# EAGLE design RfM v4 KOVAN (EAGLE 7.1.0)
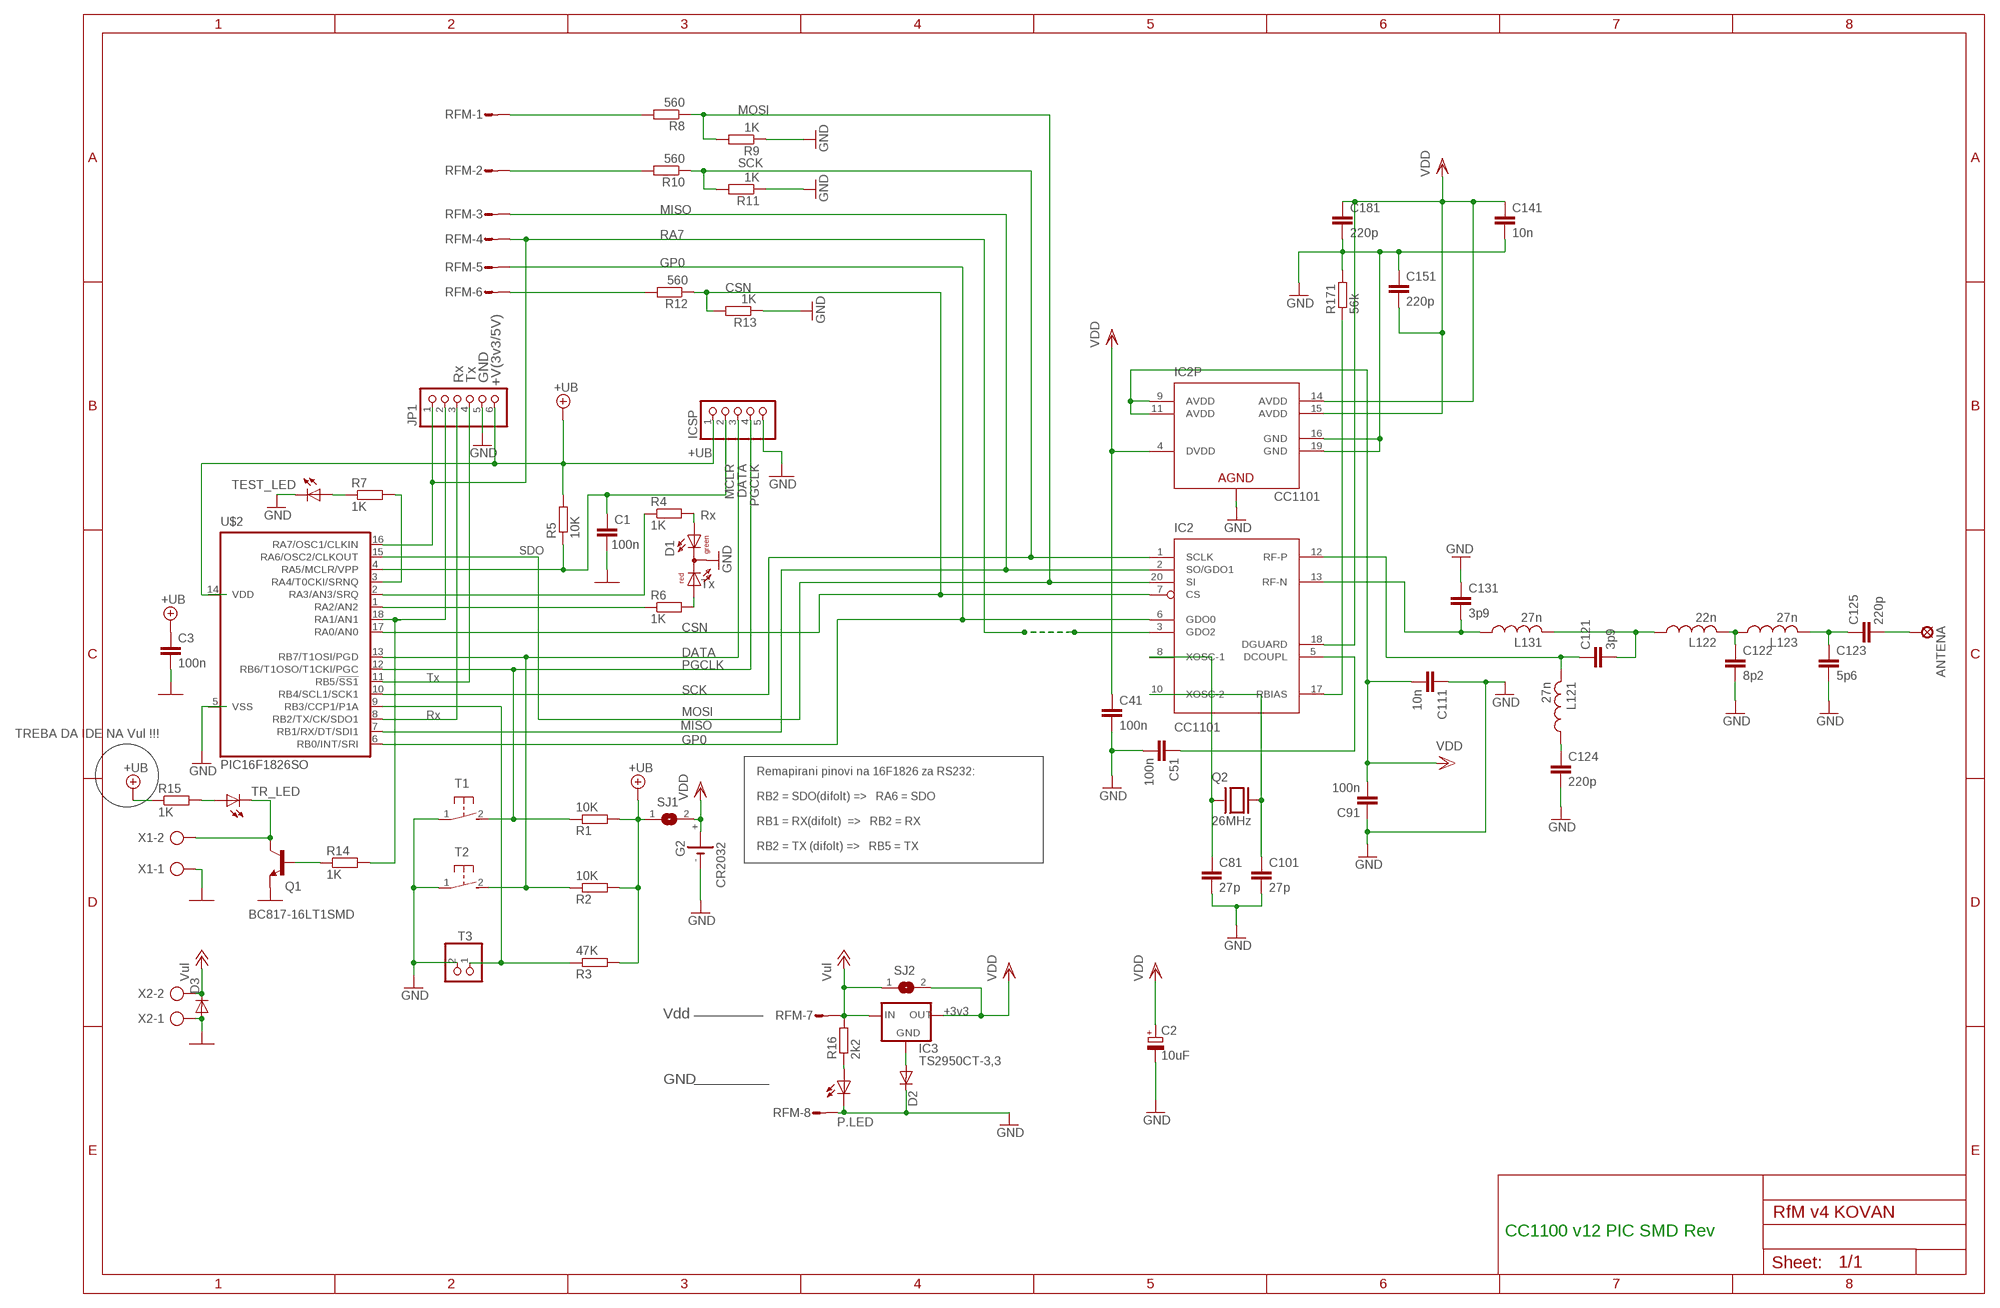
[diagram p0: schematic, sheet 1]

## Parts
ANTENA  SE13  [SE13]
C1  100n  C-EUC0805  [C0805]
C2  10uF  CPOL-EUSMD  [ALUCON]
C3  100n  C-EUC1206  [C1206]
C41  100n  C-EUC0402  [C0402]
C51  100n  C-EUC0402  [C0402]
C81  27p  C-EUC0402  [C0402]
C91  100n  C-EUC0402  [C0402]
C101  27p  C-EUC0402  [C0402]
C111  10n  C-EUC0402  [C0402]
C121  3p9  C-EUC0402  [C0402]
C122  8p2  C-EUC0402  [C0402]
C123  5p6  C-EUC0402  [C0402]
C124  220p  C-EUC0402  [C0402]
C125  220p  C-EUC0402  [C0402]
C131  3p9  C-EUC0402  [C0402]
C141  10n  C-EUC0402  [C0402]
C151  220p  C-EUC0402  [C0402]
C181  220p  C-EUC0402  [C0402]
D1  DUOLED2X5.  [DUOLED2X5*]
D2  1N4004SMD  [1N4007-SMD]
D3  1N4004SMD  [1N4007-SMD]
G2  CR2032  CR2032H,  [CR2032--]
IC2  CC1101  CC1100  [QLP-20]
IC3  TS2950CT-3,3  78LXX  [78LXX]
ICSP  PINHD-1X5.  [1X05.]
JP1  PINHD-1X6.  [1X06.]
L121  27n  L-USL0402  [C0402]
L122  22n  L-USL0402  [C0402]
L123  27n  L-USL0402  [C0402]
L131  27n  L-USL0402  [C0402]
P.LED  zelena  LEDCHIPLED_0805  [CHIPLED_0805]
Q1  BC817-16LT1SMD  [SOT23-BEC]
Q2  26MHz  XTALSMDMOJ  [SMD]
R1  10K  R-EU_R0805  [R0805]
R2  10K  R-EU_R0805  [R0805]
R3  47K  R-EU_R0603  [R0603]
R4  1K  R-EU_R0805  [R0805]
R5  10K  R-EU_R0603  [R0603]
R6  1K  R-EU_R0805  [R0805]
R7  1K  R-EU_R0603  [R0603]
R8  560  R-EU_R0603  [R0603]
R9  1K  R-EU_R0603  [R0603]
R10  560  R-EU_R0603  [R0603]
R11  1K  R-EU_R0603  [R0603]
R12  560  R-EU_R0603  [R0603]
R13  1K  R-EU_R0603  [R0603]
R14  1K  R-EU_R1206  [R1206]
R15  1K  R-EU_R0603  [R0603]
R16  2k2  R-EU_R0805  [R0805]
R171  56k  R-EU_R0402  [R0402]
RFM  MICROMATCH-8'  [MICROMATCH-8..]
SJ1  SJ  [SJ]
SJ2  SJ  [SJ]
T1  10-XX-1'  [3BF-10XX-1.]
T2  10-XX-1'  [3BF-10XX-1.]
T3  PINHD-1X2.  [1X02.]
TEST_LED  TEST_LED  LEDCHIPLED_0805  [CHIPLED_0805]
TR_LED  TEST_LED  LEDCHIPLED_0805  [CHIPLED_0805]
U$2  PIC16F1826SO  [SO-18W]
X1  AK300/2  [AK300/2]
X2  AK300/2  [AK300/2]

## Nets
+12V: D3.C IC3.IN R16.2 RFM.7 SJ2.1 X2.2 ; supply symbol labelled Vul
+UB: C3.2 ICSP.1 JP1.6 R1.2 R2.2 R3.2 R5.2 R15.1 SJ1.1 U$2.14(VDD)
CSN: IC2.7(CS) R12.1 R13.2 U$2.17(RA0/AN0)
DATA: ICSP.3 R2.1 T2.2(S) U$2.13(RB7/T1OSI/PGD)
DCOUPL: C51.2 IC2.5(DCOUPL)
GND: C1.1 C2.P$1(-) C3.1 C41.1 C51.1 C81.1 C91.2 C101.1 C111.2 C122.1 C123.1 C124.1 C131.2 C141.1 C151.2 C181.1 D1.K(C) D2.C D3.A G2.- IC2.16(GND) IC2.19(GND) IC2.21(AGND) ICSP.5 JP1.5 Q1.E R9.1 R11.1 R13.1 R171.2 RFM.8 T1.1(P) T2.1(P) T3.2 TEST_LED.C U$2.5(VSS) X1.1 X2.1
GP0: IC2.6(GDO0) RFM.5 U$2.6(RB0/INT/SRI)
MCLR: C1.2 ICSP.2 R5.1 U$2.4(RA5/MCLR/VPP)
MISO: IC2.2(SO/GDO1) RFM.3 U$2.7(RB1/RX/DT/SDI1)
MOSI: IC2.20(SI) R8.1 R9.2 U$2.15(RA6/OSC2/CLKOUT)
N$1: IC2.17(RBIAS) R171.1
N$2: C101.2 IC2.10(XOSC-2) Q2.P$5
N$3: C81.2 IC2.8(XOSC-1) Q2.P$3
N$4: C131.1 IC2.13(RF-N) L131.2
N$5: C121.2 IC2.12(RF-P) L121.1
N$7: C124.2 L121.2
N$8: C123.2 C125.2 L123.1
N$9: C122.2 L122.1 L123.2
N$10: ANTENA.MP C125.1
N$13: D1.AG R4.2
N$14: R7.1 TEST_LED.A
N$15: C121.1 L122.2 L131.1
N$33: D1.AR R6.2
N$35: JP1.2 R14.2 U$2.18(RA1/AN1)
N$38: Q1.B R14.1
N$40: R15.2 TR_LED.A
N$41: Q1.C TR_LED.C X1.2
N$45: D2.A IC3.GND
N$48: IC2.3(GDO2)
N$56: R8.2 RFM.1
N$57: R10.2 RFM.2
N$58: R12.2 RFM.6
N$60: P.LED.A R16.1
N$61: P.LED.C
PGCLK: ICSP.4 R1.1 T1.2(S) U$2.12(RB6/T1OSO/T1CKI/PGC)
RA2: R6.1 U$2.1(RA2/AN2)
RA3: R4.1 U$2.2(RA3/AN3/SRQ)
RA4: R7.2 U$2.3(RA4/T0CKI/SRNQ)
RA7: JP1.1 RFM.4 U$2.16(RA7/OSC1/CLKIN)
RB3: R3.1 T3.1 U$2.9(RB3/CCP1/P1A)
RX: JP1.3 U$2.8(RB2/TX/CK/SDO1)
SCK: IC2.1(SCLK) R10.1 R11.2 U$2.10(RB4/SCL1/SCK1)
TX: JP1.4 U$2.11(RB5/!SS1)
VDD: C2.P$4(+) C41.2 C91.1 C111.1 C141.2 C151.1 C181.2 G2.+ G2.+@1(+) IC2.4(DVDD) IC2.9(AVDD) IC2.11(AVDD) IC2.14(AVDD) IC2.15(AVDD) IC2.18(DGUARD) IC3.OUT SJ1.2 SJ2.2

## Notes on the sheet
- Rx | Tx | GND | +V(3v3/5V)
- Rx
- SDO
- Tx
- Tx
- Rx
- TREBA DA IDE NA Vul !!!
- Remapirani pinovi na 16F1826 za RS232:
- RB2 = SDO(difolt) =>   RA6 = SDO
- RB1 = RX(difolt)  =>   RB2 = RX
- RB2 = TX (difolt) =>   RB5 = TX
- Vdd | +3v3
- GND
- CC1100 v12 PIC SMD Rev

## Library data of the parts
ANTENA = solpad:SE13: SOLDER PAD E1542, drill 1,3mm, distributor Buerklin, 07F815
C1 C3 C41 C51 C81 C91 C101 C111 C121-C125 C131 C141 C151 C181 = rcl:C-EU: CAPACITOR, European symbol
C2 = rcl:CPOL-EU: POLARIZED CAPACITOR, European symbol
D1 = led_1:DUOLED2X5: DUO LED 2 colors, 2.5 x 5 mm, recangle
D2 D3 = diode_1:1N4004: DIODE general purpose rectifier, 1 A
G2 = battery:CR2032H: LI BATTERY Varta
IC2 = chipcon-ti:CC1100: Single Chip Low Cost Low Power RF Transceiver 315/433/868 and 915 MHz ISM/SRD band systems
IC3 = v-reg:78LXX: VOLTAGE REGULATOR
ICSP = pinhead:PINHD-1X5: PIN HEADER
JP1 = pinhead:PINHD-1X6: PIN HEADER
L121-L123 L131 = rcl:L-US: INDUCTOR, American symbol
P.LED TEST_LED TR_LED = LED:LED: LED OSRAM: - CHIPLED LG R971, LG N971, LY N971, LG Q971, LY Q971, LO R971, LY R971 LH N974, LH R974 LS Q976, LO Q976, LY Q976 LO Q996 - Hyper CHIPLED LW Q18S LB Q993, LB Q99A, LB R99A - SideLED LS A670, LO A670, LY A670, LG A670, LP A670 LB A673, LV A673, LT A673, LW A673 LH A674 LY A675 LS A676, LA A676, LO A676, LY A676, LW A676 LS A679, LY A679, LG A679 - Hyper Micro SIDELED® LS Y876, LA Y876, LO Y876, LY Y876 LT Y87S - SmartLED LW L88C, LW L88S LB L89C, LB L89S, LG L890 LS L89K, LO L89K, LY L89K LS L896, LA L896, LO L896, LY L896 - TOPLED LS T670, LO T670, LY T670, LG T670, LP T670 LSG T670, LSP T670, LSY T670, LOP T670, LYG T670 LG T671, LOG T671, LSG T671 LB T673, LV T673, LT T673, LW T673 LH T674 LS T676, LA T676, LO T676, LY T676, LB T676, LH T676, LSB T676, LW T676 LB T67C, LV T67C, LT T67C, LS T67K, LO T67K, LY T67K, LW E67C LS E67B, LA E67B, LO E67B, LY E67B, LB E67C, LV E67C, LT E67C LW T67C LS T679, LY T679, LG T679 LS T770, LO T770, LY T770, LG T770, LP T770 LB T773, LV T773, LT T773, LW T773 LH T774 LS E675, LA E675, LY E675, LS T675 LS T776, LA T776, LO T776, LY T776, LB T776 LHGB T686 LT T68C, LB T68C - Hyper Mini TOPLED® LB M676 - Mini TOPLED Santana® LG M470 LS M47K, LO M47K, LY M47K Source: http://www.osram.convergy.de/
Q1 = transistor-npn:BC817*: NPN Transistor
Q2 = special:XTAL: CRYSTAL
R1-R6 = moja:R-EU_: RESISTOR, European symbol
R7 R14-R16 = rcl-1:R-EU_: RESISTOR, European symbol
R8-R13 R171 = rcl:R-EU_: RESISTOR, European symbol
RFM = con-amp-micromatch:MICROMATCH-8: MicroMaTch 8 7-215464-8 / 0-215464-8 Drawing Number C-215464 DDEController.pdf
SJ1 SJ2 = jumper:SJ: SMD solder JUMPER
T1 T2 = switch-omron:10-XX-1
T3 = pinhead:PINHD-1X2: PIN HEADER
U$2 = microchip-4:PIC16F1826
X1 X2 = con-ptr500:AK300/2: CONNECTOR

## Net classes
0 gnd: clearance 0.762 mm
1 POWER: width 0.406 mm, clearance 0.381 mm

## Board
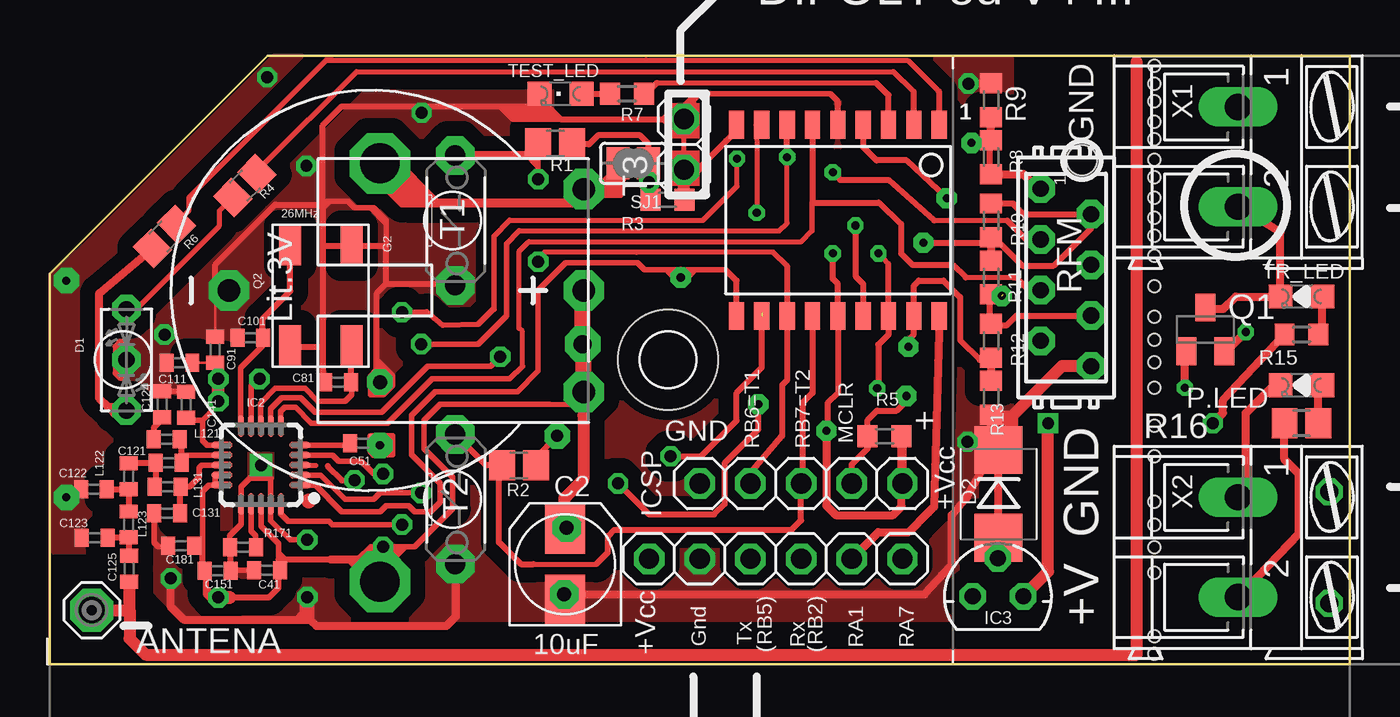
[diagram p1: board, top side]
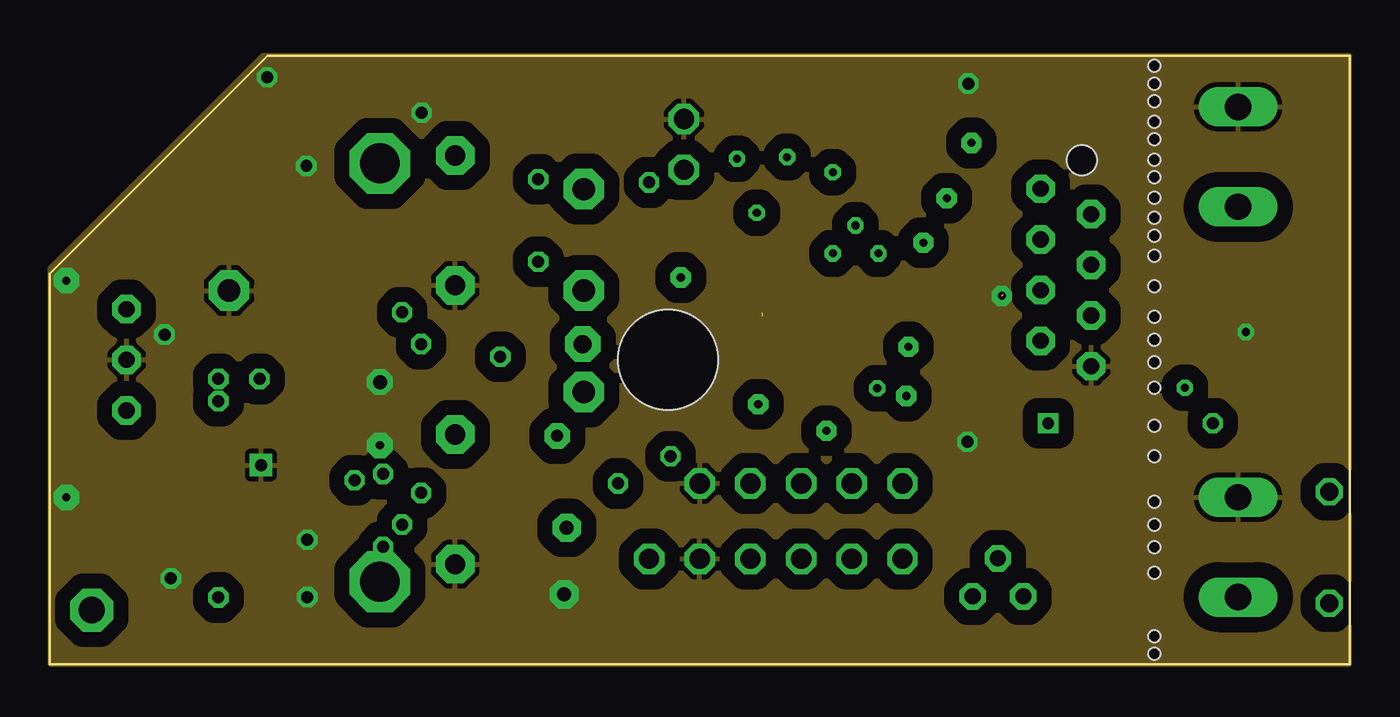
[diagram p2: board, inner layer GND$]
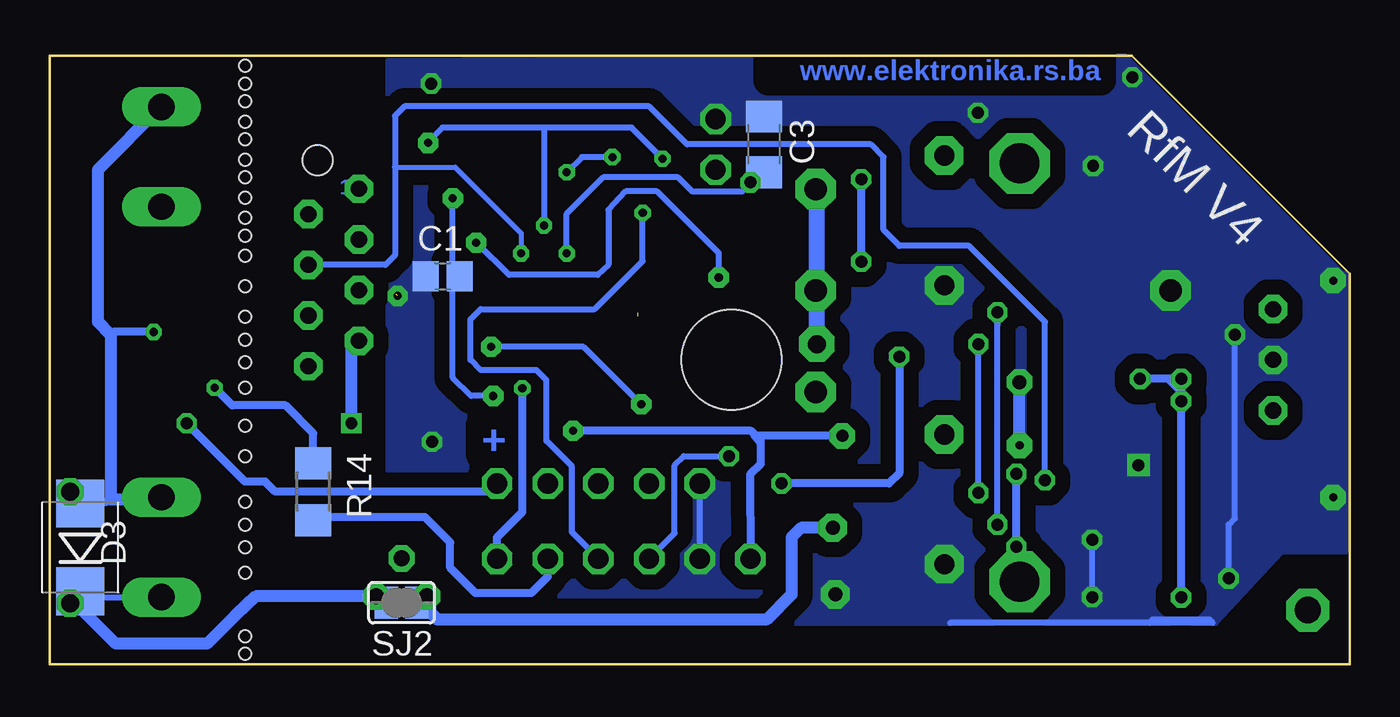
[diagram p3: board, bottom side, seen from below]

Size 65.15 x 30.48 mm. Coordinates in mm from the lower left corner, seen from the top.
Outline: 0,0 0,19.56 10.92,30.48 65.15,30.48 65.15,0 0,0
Copper layers (1+2*16): Top 0.035mm / dielectric 0.75mm / GND$ 0.035mm / dielectric 0.75mm / Bottom 0.035mm
Design rules "default": minimum track width 10mil, minimum drill 24mil, track to track 10mil, track to pad 10mil, pad to pad 10mil, via to via 8mil, smd to smd 10mil, copper to edge 0mil, drill to drill 8mil, minimum pad ring 10mil, minimum via ring 8mil, stop-mask expansion 0mil, vias tented up to drill 0mil, thermal gap 10mil
Holes 0.6 mm at 55.37,29.08 55.37,27.18 55.37,25.27 55.37,21.46 55.37,17.4 55.37,13.84 55.37,11.94 55.37,10.41 55.37,8.13 55.37,0.51 55.37,29.97 55.37,26.29 55.37,24.38 55.37,22.35 55.37,20.45 55.37,18.92 55.37,16.26 55.37,6.99 55.37,4.57 55.37,1.4 55.37,15.11 55.37,23.37 55.37,5.84 55.37,28.19

### Footprints (pad centres in the part's own frame; a part is rotated, then mirrored left to right if it is on the bottom)
SE13 = drill 1.321 pad 2.159 octagon: MP 0,0
C0805 = smd 1.3 x 1.5: 1 -0.85,0; 2 0.85,0
ALUCON = smd 2.5 x 2: P$1 -1.778,0; P$4 1.778,0
C1206 = smd 1.6 x 1.8: 1 -1.4,0; 2 1.4,0
C0402 = smd 0.7 x 0.9: 1 -0.65,0; 2 0.65,0
DUOLED2X5* = drill 0.813 pad 1.422 octagon: AG -2.54,0; AR 2.54,0; K 0,0
1N4007-SMD = smd 2.4 x 2.4: A 2.2,0; C -2.2,0
CR2032-- = drill 1.118 pad 2.032 octagon: + 5.08,10.795; +@1 -5.08,10.795; +@2 0,10.795; - 0,-6.985
QLP-20 = smd 1.041 x 0.3: 1 -1.954,1; 2 -1.951,0.5; 3 -1.951,0; 4 -1.951,-0.5; 5 -1.951,-1; 11 1.951,-1; 12 1.951,-0.5; 13 1.951,0; 14 1.951,0.5; 15 1.951,1 | smd 0.3 x 1.041: 6 -1,-1.951; 7 -0.5,-1.951; 8 0,-1.951; 9 0.5,-1.951; 10 1,-1.951; 16 1,1.951; 17 0.5,1.951; 18 0,1.951; 19 -0.5,1.951; 20 -1,1.951 | drill 0.6 pad 1 square: 21 0,0
78LXX = drill 0.813 octagon: GND 0,1.905; IN 1.27,0; OUT -1.27,0
1X05. = drill 1.016 octagon: 1 -5.08,0; 2 -2.54,0; 3 0,0; 4 2.54,0; 5 5.08,0
1X06. = drill 1.016 octagon: 1 -6.35,0; 2 -3.81,0; 3 -1.27,0; 4 1.27,0; 5 3.81,0; 6 6.35,0
CHIPLED_0805 = smd 1.2 x 1.2: A 0,-1.05; C 0,1.05
SOT23-BEC = smd 1 x 1.4: B -0.95,-1.1; C 0,1.1; E 0.95,-1.1
SMD = smd 2 x 1.1: P$2 -2.512,1.679; P$3 2.466,1.679; P$4 2.469,-1.41; P$5 -2.54,-1.397
R0805 = smd 1.3 x 1.5: 1 -0.85,0; 2 0.85,0
R0603 = smd 1 x 1.1: 1 -0.85,0; 2 0.85,0
R1206 = smd 1.6 x 1.803: 1 -1.422,0; 2 1.422,0
R0402 = smd 0.7 x 0.9: 1 -0.65,0; 2 0.65,0
MICROMATCH-8.. = drill 0.813 pad 1.422 octagon: 1 4.445,1.27; 2 3.175,-1.27; 3 1.905,1.27; 4 0.635,-1.27; 5 -0.635,1.27; 6 -1.905,-1.27; 7 -3.175,1.27; 8 -4.445,-1.27 | hole 1.5: 5.874,-0.794
SJ = smd 1.168 x 1.6: 1 -0.762,0; 2 0.762,0
3BF-10XX-1. = drill 1.016 pad 1.93 octagon: 1 -3.251,0.356; 2 3.251,0.356
1X02. = drill 1.016 octagon: 1 -1.27,0; 2 1.27,0
KUTIJA_ZA_DALJINSKI = hole 5: 15.24,13.335
SO-18W = smd 0.762 x 1.397: 1 -5.08,-4.788; 2 -3.81,-4.788; 3 -2.54,-4.788; 4 -1.27,-4.788; 5 0,-4.788; 6 1.27,-4.788; 7 2.54,-4.788; 8 3.81,-4.788; 9 5.08,-4.788; 10 5.08,4.788; 11 3.81,4.788; 12 2.54,4.788; 13 1.27,4.788; 14 0,4.788; 15 -1.27,4.788; 16 -2.54,4.788; 17 -3.81,4.788; 18 -5.08,4.788
AK300/2 = drill 1.321 long: 1 -2.515,0; 2 2.489,0

### Placement (x,y rotation side)
ANTENA  2.1,2.7 0 top
C1  45.47,19.43 0 bottom
C2  25.83,5 90 top
C3  29.36,26.04 270 bottom
C41  10.88,4.69 0 top
C51  15.7,11.06 180 top
C81  14.45,14.12 0 top
C91  8.29,15.75 90 top
C101  10.05,16.34 0 top
C111  6.5,15.1 180 top
C121  5.95,10.08 0 top
C122  2.21,8.76 0 top
C123  2.25,6.34 0 top
C124  5.62,13.02 270 top
C125  3.98,4.78 90 top
C131  5.87,7.55 180 top
C141  6.83,13 270 top
C151  8.41,4.68 0 top
C181  6.57,5.92 0 top
D1  3.84,15.24 270 top
D2  47.55,8.52 270 top
D3  63.63,5.84 90 bottom
G2  15.96,18.71 270 top
IC2  10.58,9.97 180 top
IC3  47.52,3.39 0 top
ICSP  37.66,9.05 180 top
JP1  36.39,5.27 180 top
L121  5.85,11.27 180 top
L122  3.96,9.4 90 top
L123  3.96,6.99 90 top
L131  5.91,8.88 0 top
P.LED  62.74,13.97 90 top
Q1  57.91,16.76 0 top
Q2  13.45,18.45 270 top
R1  25.33,26.09 0 top
R2  23.51,9.95 0 top
R3  30.96,23.26 180 top
R4  9.77,23.98 225 top
R5  41.84,11.41 0 top
R6  5.75,21.43 225 top
R7  28.92,28.57 0 top
R8  47.18,25.4 270 top
R9  47.18,28.26 270 top
R10  47.18,22.23 90 top
R11  47.18,19.37 90 top
R12  47.18,16.19 90 top
R13  47.18,13.34 90 top
R14  51.94,8.64 270 bottom
R15  62.74,16.51 0 top
R16  62.74,12.06 180 top
R171  9.69,5.84 180 top
RFM  50.93,19.37 90 top
SJ1  29.24,25.08 180 top
SJ2  47.52,3.07 0 bottom
T1  20.67,22.22 90 top
T2  20.67,8.25 90 top
T3  31.78,26.04 90 top
TEST_LED  25.59,28.58 90 top
TR_LED  62.74,18.41 90 top
U$1  [KUTIJA_ZA_DALJINSKI]  44.32,0 90 top
U$2  39.5,22.23 180 top
X1  59.56,25.4 270 top
X2  59.56,5.84 270 top

### Tracks (layer width: path | path; a pad name or v marks a point on that pad's centre or on a via)
+12V  (via drill 0.6)
  Top 0.406: R16.2 61.89,10.25 62.61,9.53 62.61,6.53 X2.2
  Top 0.61: v50.04,12.06 50.04,4.64 IC3.IN
  Bottom 0.254: IC3.IN 48.6,3.39 SJ2.1
  Bottom 0.305: D3.C 63.36,3.34 X2.2
  Bottom 0.61: RFM.7 50.04,15.81 v50.04,12.06 | IC3.IN 54.83,3.39 55.84,2.45 57.28,1.02 61.85,1.02 63.37,2.54 D3.C
+UB  (via drill 0.41, 0.41 pad 1.02, 0.6, 0.6 pad 1.02, 0.6 pad 1.27)
  Top 0.279: R5.2 42.74,11.52 | 38.97,11.54 v38.93,11.68 38.97,11.47 | SJ1.1 30,23.37 R3.2 29.95,23.26 30.04,23.34 | SJ1.1 30,25.11 30.04,25.08 SJ1.1 | 26.23,26.04 R1.2
  Top 0.305: SJ1.1 30,26.07 29.59,26.49 27.47,26.49 27.02,26.04 26.23,26.04 | v30.04,24.13 30.04,23.34 | R2.2 24.36,10.36 v25.43,11.43 | v38.93,11.68 38.99,11.75 38.99,13.08 39.5,13.59 U$2.14 39.5,19.05 39.24,19.3 v39.24,20.57
  Top 0.406: 42.74,11.52 ICSP.1 | R5.2 42.69,7.89 42.26,7.46 39.4,7.46 38.93,7.94 v38.93,11.68 | v58.29,12.06 58.8,12.57 58.8,13.21 R15.1
  Bottom 0.305: C3.2 29.53,24.64 v30.04,24.13 30.46,23.67 32.94,23.67 33.65,24.38 37.41,24.38 39.24,22.55 v39.24,20.57
  Bottom 0.406: v38.93,11.68 30,11.68 29.53,11.21 29.53,11.08 | 29.53,11.08 29.53,10.02 30.05,9.5 JP1.6 | v25.43,11.43 29.81,11.43 29.53,11.08 | ICSP.1 43.15,8.64 53.85,8.64 54.36,9.14 55.37,9.14 v58.29,12.06
CSN  (via drill 0.41 pad 1.02, 0.6 pad 1.02)
  Top 0.279: v22.57,15.4 22.1,14.92 18.92,14.92 16.62,12.62 13.29,12.62 12.58,13.34 11.62,13.34 11.07,12.78 11.08,12.77 IC2.7
  Top 0.305: v43.03,15.89 43.03,16.24 43.31,16.51 43.29,17.71 | v35.51,13.02 35.51,11.76 33.83,10.08 33.83,8.03 33.3,7.49 30.04,7.49 v28.48,9.05 | 43.29,17.71 43.29,18.93 43.56,19.21 44.8,19.21 45.62,18.38 45.62,16.29 45.62,16.22 46.61,15.24 47.08,15.24 R12.1 | 43.29,17.71 U$2.17
  Top 0.406: R12.1 R13.2
  Bottom 0.305: v43.03,15.89 38.41,15.89 v35.51,13.02
  Bottom 0.406: v22.57,15.4 22.57,9.56 23.08,9.05 | 23.08,9.05 v28.48,9.05 | 23.08,9.05
DATA
  Top 0.254: 24.24,5 27.38,5
  Top 0.279: ICSP.3 | ICSP.3 37.7,9.09
  Top 0.305: 24.24,5 23.61,5 22.51,6.1 22.51,9.8 R2.1 21.87,9.95 T2.2 | 27.38,5 27.97,5.59 27.97,6.41 28.29,6.72 37.18,6.72 37.66,7.2 ICSP.3 37.72,9.11 37.72,13.08 38.23,13.59 U$2.13
DCOUPL
  Top 0.279: C51.2 15.13,11.13 | C51.2 15.14,11.13 | IC2.5 15.14,10.97 C51.2
GND  (via drill 0.41, 0.41 pad 1.02, 0.41 pad 1.27, 0.6 pad 1.02, 0.7 pad 1.27, 0.7 pad 1.42)  (1 unrouted)
  Top 0.127: C91.2 8.29,18.57
  Top 0.279: 16.07,22.86 16.86,22.07 | 16.86,20.95 16.86,22.23 16.22,22.86 | 16.22,22.86 | C131.2 5.22,6.08 5.43,5.87 5.96,5.87 C181.1 | C124.1 6.96,13.67 C141.1 | C41.1 9.07,4.69 C151.2 | 9.06,5.91 R171.2 9,5.96 9,6.43 9.59,7.01 9.59,8.08 | 10.59,9.31 10,9.31 10.03,9.34 9.59,8.89 9.59,8.08 | 10.59,9.31 11.09,9.31 11.08,9.3 IC2.19 | 13.78,14.14 C81.1 13.69,14.12 13.68,14.13 | 8.29,18.57 8.43,18.71 | C51.1 16.48,10.9 v16.54,10.95 | v16.54,14.13 16.38,14.29 | 39.48,28.21 39.12,28.57 32.42,28.57 | 32.42,28.57 31.78,27.94 T3.2 31.78,27.78 | 16.38,14.76 16.38,14.92 | 16.38,14.76 16.07,14.45 16.07,13.65 | 16.07,13.65 16.07,13.49 16.7,13.49 17.18,13.97 17.18,14.45 16.86,14.76 | 16.86,14.76 16.38,15.24 | 16.07,13.65 16.86,13.65 | 16.38,14.76 16.86,14.76 | 9.59,8.08 IC2.16 | IC2.21 10.58,9.32 10.59,9.31 | 11.07,8.1 11.07,7.18 12.03,6.23 v12.9,6.23 | 32.58,28.57 32.26,28.26 32.26,27.78 31.78,27.78 | 25.59,27.3 23.21,27.3 23.05,27.46 | 22.89,27.62 23.05,27.46 | 22.73,27.78 22.57,27.94 | 23.05,27.46 25.43,27.46 25.11,27.78 22.73,27.78 | 22.89,27.62 22.73,27.78 | 25.27,27.62 22.89,27.62 | 25.59,27.3 | 25.59,27.3 24.96,27.94 22.57,27.94 | 22.57,27.94 | 3.48,16 3.47,16 3.47,16.09 | 15.11,20.95 15.43,20.95 | 31.62,27.78 31.78,27.78 | 31.62,27.78 31.23,27.78 | 32.42,28.57 | 32.42,28.57 31.62,27.78 | 14,23.18 14.95,23.18 15.27,22.86 16.07,22.86 | 13.68,23.18 14,23.18 | 16.07,22.86 16.22,22.86 | 13.68,23.18 | 13.68,23.18 13.52,23.02 13.68,22.86 14,23.18 | 16.86,19.05
  Top 0.305: C151.2 9.06,5.91 | 13.68,15.88 13.68,18.73 13.68,22.86 13.68,23.02 | 13.68,15.88 13.68,14.13 | 8.29,18.57 8.29,20 11.3,23.02 13.68,23.02 | 8.43,18.71 G2.- | 16.38,14.29 16.38,18.57 16.86,19.05 | 16.86,19.05 20.35,19.05 | 14.64,27.94 | 14.64,27.94 22.57,27.94 24.96,27.94 25.27,27.62 25.59,27.3 | 25.59,27.3 | 25.59,27.3 T3.2 | 14.64,27.94 13.68,26.99 13.68,23.18 13.68,23.02 | 13.68,15.88 12.1,15.88 | 13.68,20.95 15.11,20.95 | 15.43,20.95 16.86,20.95 16.86,19.05 | 30.75,27.3 | 30.75,27.3 31.23,27.78 31.23,26.83 30.75,27.3 | 3.48,14.55 3.48,16 | U$2.5 39.5,28.19 39.48,28.21 | 3.52,16.14 3.68,16.14 3.68,14.35 3.52,14.35 3.29,14.58 3.29,15.9 3.47,16.09 3.52,16.14
  Top 0.406: 13.37,1.91 | 13.37,1.91 19.88,1.91 | 19.88,1.91 | 13.37,1.91 | 19.88,1.91 | 13.37,1.91 19.88,1.91 | 13.05,2.22 13.37,1.91 | 12.89,2.38 12.89,3.33 | 19.88,1.91 20.35,2.38 | 20.35,2.38 20.35,4.92 | 12.89,2.38 13.05,2.22 | 13.05,2.22 13.37,1.91 | 19.88,1.91 20.35,2.38 | v46.04,29.08 47.2,29.08 R9.1 | R13.1 47.18,10.48 45.94,8.32 45.21,7.46 45.21,4.99 43.85,3.49 25.75,3.49 | R11.1 47.79,18.52 | 13.05,2.22 13.05,3.33 12.73,3.33 12.73,2.54 | 12.73,2.54 12.89,2.38 | 12.41,2.22 6.7,2.22 6.06,2.86 v6.06,4.29 | 12.41,2.22 12.73,2.22 | 12.73,2.22 13.05,2.22 | 12.73,2.22 12.73,2.54 | 12.41,2.22 12.73,2.54 | 47.12,12.5 48.34,12.5 48.34,11.89 48.03,11.58 | 47.57,11.12 D2.C 47.37,10.9 47.37,12.19 48.01,12.19 | Q1.E 58.97,15.66 v59.94,16.64
  Top 0.61: 51.99,14.94 50.75,14.94 48.01,12.19
  Bottom 0.254: D3.A 62.32,8.04 62.1,8.26
  Bottom 0.305: 32.58,5.23 32.58,9.02 | v6.06,4.29 6.06,6.99 5.75,7.3 v5.75,16.51 | 12.89,24.92 v12.86,24.96 | v12.86,24.96 | 12.9,3.33 v12.9,6.23 | 6.86,2.06 10.03,2.06 | 10.03,2.06 20.03,2.06 | 6.86,2.06 | 6.86,2.06 7.02,2.22 9.87,2.22 10.03,2.06
  Bottom 0.406: v59.94,16.64 61.98,16.64 62.1,16.51
  Bottom 0.61: v16.54,10.95 v16.54,14.13 | 59.56,8.26 62.1,8.26 62.1,16.51 62.74,17.14 62.74,24.77 59.56,27.94
  other vias: 25.78,3.49 0.83,8.35 0.83,19.21 10.89,29.4 12.9,3.35 47.72,18.45 45.99,11.13 18.64,27.62
  pour Top (isolate 0.508, no thermals): 0.19,19.53 2.25,21.43 11.3,30.48 48.2,30.32 48.2,2.25 45.66,2.25 6.6,2.25 3.4,5.62 0.19,5.62
  pour Bottom (isolate 0.508, no thermals): 0.22,19.56 0.22,5.62 3.4,5.62 6.73,2.03 48.13,2.03 48.18,30.23 11.3,30.48 0.25,19.43
  pour GND$: 0,0 65.15,0 65.15,30.48 10.67,30.48 0,19.81 0,19.68
GP0
  Top 0.254: 23.69,14.92 23.69,16.67 23.53,16.83 23.53,20.69 24,21.16 37.67,21.16 38.21,21.7 | 45.91,19.37 48.29,19.37
  Top 0.279: 38.21,21.7 38.21,23.11 | 23.69,14.92 23.05,14.29 19.16,14.29 16.94,12.06 16.86,12.06 13.11,12.06 12.31,12.86 11.78,12.86 11.58,12.66 IC2.6 | 23.53,16.83
  Top 0.305: 45.91,19.37 45.28,20 43.24,20 42.67,20.57 42.67,22.05 41.55,23.11 38.21,23.11 38.23,23.13 U$2.6 | RFM.5 49.09,18.73 48.45,19.37 48.29,19.37
MCLR  (via drill 0.41 pad 1.02)
  Top 0.279: 40.99,11.57 R5.1 40.99,11.57
  Top 0.305: ICSP.2 40.2,10 40.99,10.79 40.99,11.57 | 40.99,11.57 40.99,12.22 41.46,12.7 42.45,12.7 42.93,13.18 42.93,13.68 | v44.96,23.34 44.96,23.37 42.96,25.24 41.43,25.24 40.75,25.93 40.77,26.2 U$2.4
  Top 0.406: 42.93,13.68 v42.93,13.43
  Bottom 0.254: C1.2 44.96,19.43 44.96,19.56
  Bottom 0.305: v42.93,13.43 44.04,13.43 44.96,14.35 44.96,19.56 v44.96,23.34
MISO  (via drill 0.41, 0.6 pad 1.02)
  Top 0.254: 23.53,21.7 29.4,21.7 36.56,21.7 36.96,22.1 v36.96,25.4 | 44.32,22.23 47.97,22.23
  Top 0.279: 23.53,21.7 22.89,21.06 22.89,17.46 21.46,16.03 v18.61,16.03 | v18.61,8.57 16.54,8.57 16.22,8.26 14.8,8.26 13.58,9.47 IC2.2 | 29.4,21.7
  Top 0.305: 48.93,21.27 RFM.3 48.93,21.27 | 47.97,22.23 48.29,21.91 | 48.29,21.91 48.93,21.27 | 44.32,22.23 42.04,24.26 39.62,24.26 v39.24,24.64 | 48.29,21.91 48.93,21.27 | v36.96,25.4 U$2.7
  Bottom 0.305: v18.61,8.57 v18.61,16.03 | v36.96,25.4 38.48,25.4 v39.24,24.64
MOSI  (via drill 0.41, 0.41 pad 1.02, 0.6 pad 1.02)
  Top 0.254: 23.05,22.23 29.4,22.23 32.73,22.23 34.44,23.93 v34.44,25.32
  Top 0.279: 23.05,22.23 22.26,21.43 22.26,17.78 22.23,17.78 21.46,17.02 19.69,16.99 18.89,17.65 v17.65,17.62 | 17.34,6.99 v17.65,6.99 14.16,6.99 | 11.94,7.14 11.59,7.5 11.58,7.5 IC2.20 | 11.94,7.14 | 11.94,7.14 | 11.94,7.14 14,7.14 14.16,6.99 | 14.16,6.99 | 29.4,22.23
  Top 0.305: v46.2,26.11 47.12,26.36 R8.1 | v40.39,21.97 40.39,19.43 40.77,19.05 40.77,17.89 U$2.15
  Top 0.406: R8.1 R9.2
  Bottom 0.254: 40.39,26.87
  Bottom 0.305: v17.65,6.99 v17.65,17.62 17.65,16.99 | v46.2,26.11 45.47,26.87 40.39,26.87 | v34.44,25.32 35.99,26.87 40.39,26.87 | 40.39,26.87 v40.39,21.97
N$1
  Top 0.279: IC2.17 10.08,6.65 10.31,6.42 10.31,5.95 R171.1
N$2
  Top 0.279: 10.67,16.37 C101.2 10.67,16.3 10.67,15.95 9.57,14.85 9.57,11.88 IC2.10
  Top 0.305: Q2.P$5 12.05,18.69 10.67,17.3 10.67,16.37
N$3
  Top 0.279: C81.2 15.11,14.11 15.11,13.49 14.8,13.18 13.42,13.18 12.79,13.81 11.3,13.81 10.57,13.07 10.57,11.88 IC2.8 | 15.1,15.79 Q2.P$3
  Top 0.305: C81.2 15.1,15.79
N$4
  Top 0.279: 6.52,8.84 L131.2 7.02,8.89 7.49,9.36 7.49,9.37 7.49,9.84 7.62,9.97 7.94,9.97 IC2.13
  Top 0.305: C131.1 6.52,8.84
N$5
  Top 0.279: C121.2 6.6,10.46 6.8,10.47 IC2.12 | 6.6,11.17 L121.1
  Top 0.305: 6.6,10.46 6.6,11.17 | C121.2 6.59,10.47
N$6
  Top 0.279: 31.78,27.94 31.15,27.3 31.31,27.15 | 31.31,27.15 31.94,27.15 31.94,28.1 | 32.1,28.26 32.1,27.15 31.31,27.15
N$7
  Top 0.279: C124.2 5.52,12.28
  Top 0.305: 5.52,12.28 5.52,12.16 5.21,11.85 L121.2
N$8
  Top 0.279: L123.1 3.98,6.32
  Top 0.305: L123.1 C123.2 | C125.2 3.98,6.32
N$9
  Top 0.279: 3.8,8.76 L122.1 | L123.2
  Top 0.305: C122.2 3.8,8.76 | L122.1 L123.2
N$10
  Top 0.279: 4,3.97 C125.1 | 4,2.7
  Top 0.61: 4,3.97 4,2.7 4,1.27 4.79,0.48 54.48,0.48 54.48,30.16 | ANTENA.MP 4,2.7
N$11
  Top 0.254: 31.75,26.42 31.75,25.27
N$12
  Top 0.279: 11.78,5.24 11.46,5.56 11.46,6.03
  Top 0.305: 11.46,4.92 11.78,5.24
N$13
  Top 0.254: 3.84,17.84 4.38,17.84 8.51,21.97 8.51,22.72 R4.2
  Top 0.406: D1.AG 3.84,17.84
N$14
  Top 0.279: TEST_LED.A
  Top 0.305: TEST_LED.A R7.1
N$15
  Top 0.279: 5.3,8.91 L131.1 | L122.2 3.83,10.08
  Top 0.305: 5.3,8.91 C121.1 3.83,10.08
N$16
  Top 0.305: 16.94,25.32 17.02,25.32 19.24,23.1
N$17  (via drill 0.9)
  other vias: 64.14,8.64
N$18
  Top 0.305: 26.78,23.97 28.29,23.97 28.29,24.05
N$19  (via drill 0.9)
  other vias: 64.14,3.05
N$21
  Top 0.305: 30.04,24.69 30.04,23.42
N$27
  Bottom 0.406: 46.23,3.49 46.23,3.65 46.07,3.65 | 45.91,2.38 46.07,2.54
  Bottom 0.61: 46.07,2.54 46.07,3.65
N$30
  Top 0.305: 19.08,23.18 26.07,23.18 26.07,23.1
N$32
  Top 0.279: 31.95,27.89 31.93,27.89
N$33
  Top 0.305: 2.92,12.86 2.89,12.86 | 3.05,12.7 | 3.21,12.54 3.05,12.7
  Top 0.406: 3.21,12.54 3.84,12.54 D1.AR 3.84,12.86 2.92,12.86 2.48,13.3 2.48,18.58 R6.2
N$34
  Top 0.305: 47.12,17.27 47.12,18.29
N$35
  Top 0.406: JP1.2 41.53,6.6 43.05,6.6 44.05,7.6 44.32,7.87 U$2.18
  Bottom 0.406: JP1.2 40.2,4.38 41.02,3.56 43.81,3.56 45.09,4.83 45.09,6.1 46.35,7.37 51.9,7.37 R14.2
N$36
  Top 0.279: 16.54,25.08 | 16.54,25.08 17.02,25.56 19.56,23.02 18.92,23.02 | 18.13,23.02 18.76,23.02 | 17.89,23.02 18.13,23.02 | 16.22,24.77 16.07,24.61 17.65,23.02 17.81,23.02 17.89,23.02 | 16.22,24.77 16.54,25.08 | 18.76,23.02 18.92,23.02 | 18.92,23.02 16.7,25.24 | 18.76,23.02 16.54,25.08 | 18.13,23.02 16.38,24.77 | 16.22,24.77 16.38,24.61 16.22,24.77 | 16.22,24.77 17.89,23.02
N$37
  Top 0.406: 16.86,25.24 | 16.86,25.24 18.92,23.18
N$38  (via drill 0.41)
  Top 0.406: v56.9,13.84 56.9,15.6 Q1.B
  Bottom 0.406: R14.1 51.94,11.56 53.34,12.95 56.01,12.95 v56.9,13.84
N$40
  Top 0.406: TR_LED.A 63.79,16.71 R15.2
N$41
  Top 0.406: X1.2 61.69,21.64 TR_LED.C 59.44,18.41 58.8,17.78 57.91,17.78 Q1.C
N$42
  Top 0.279: 14.95,5.24 15.75,5.24
N$43
  Top 0.279: 9.24,3.33
  Top 0.305: 8.13,3.49 9.08,3.49 9.24,3.33 9.08,3.17 8.13,3.17 7.81,3.49 7.81,3.65
N$44
  Top 0.279: 9,5.79
N$45
  Top 0.406: IC3.GND 47.52,6.61 D2.A
N$46
  Top 0.406: 47.55,6.71 47.55,10.67
N$47
  Bottom 0.61: 63.37,3.56 63.37,3.05
N$49
  Top 0.254: 29.85,25.15 28.58,25.15
N$52
  Top 0.305: 47.12,24.89 47.12,25.91
N$53
  Top 0.305: 30.99,19.68 | 30.99,19.68 31.46,19.21 31.78,19.21 32.26,19.68
N$54
  Top 0.279: 17.02,10.48 16.54,10.48 16.38,10.48 16.38,10.95 16.38,11.11 | 17.02,10.48 17.18,10.48 17.18,11.43 17.02,11.43 | 17.02,11.43 16.38,11.43 | 16.38,11.43 | 16.38,11.43 16.38,11.11 | 16.38,11.43 16.54,11.11 16.38,11.11 | 17.02,10.48 17.02,11.43
  Top 0.305: 16.38,11.43 16.07,11.43 16.07,10.64 16.22,10.48 16.54,10.48
N$55
  Top 0.254: 12.83,9.96 13.33,9.96
N$56
  Top 0.406: R8.2 48.8,24.55 49.54,23.81 RFM.1
N$57
  Top 0.305: 47.42,21.29 48.74,19.96 50.32,19.96 52.2,21.84 RFM.2 52.16,22.5 48.84,22.5 48.27,23.07 R10.2
N$58
  Top 0.305: 47.24,16.99 47.97,16.99 48.45,17.46 RFM.6
  Top 0.406: R12.2 47.24,16.99
N$59
  Top 0.813: 26.7,16 26.7,18.8
N$60
  Top 0.406: R16.1 63.59,13.77 P.LED.A
N$62
  Top 0.406: 61.47,13.97 61.34,13.97 59.94,12.57 59.94,8.64 59.56,8.26
PGCLK  (via drill 0.6 pad 1.02)
  Top 0.254: 36.26,20.64 29.4,20.64 | 29.4,20.64 24.8,20.64
  Top 0.279: 36.94,19.96 36.26,20.64 | 29.4,20.64 | 24.48,26.04 R1.1 | 24.8,20.64 | 24.8,20.64 24.48,20.32 v24.48,20.16 | v24.48,24.29 24.48,24.92 | 24.48,24.92 24.48,26.04 | 24.48,26.04 R1.1 | 24.43,26.04 24.37,25.98 24.37,25.45 20.34,25.45 T1.2 20.31,25.52 20.35,25.56 24,25.56 | 24.48,24.92 23.84,25.56 24.32,26.04 24.43,26.04 | R1.1 24.43,26.04
  Top 0.305: ICSP.4 35.12,9.59 36.7,11.43 36.7,13.97 36.96,14.22 U$2.12 36.94,17.46 36.94,19.96
  Bottom 0.406: v24.48,20.16 v24.48,24.29
RA2
  Top 0.254: 44.56,28.69 43,30.24 29.88,30.24 14.16,30.24 | R6.1 6.73,22.48 6.98,22.73 6.98,23.38 13.84,30.24
  Top 0.279: 13.84,30.24 14.16,30.24 | 29.88,30.24
  Top 0.305: U$2.1 44.58,28.67 44.56,28.69
RA3
  Top 0.254: 42.29,29.69 15.37,29.69 10.62,24.94 R4.1
  Top 0.279: 42.29,29.69 43.29,28.69
  Top 0.305: U$2.2 43.31,28.67 43.29,28.69
RA4
  Top 0.254: 30.43,29.13 41.42,29.13
  Top 0.279: 41.42,29.13 42.02,28.53 | 30.43,29.13 29.88,28.57 29.78,28.42 R7.2
  Top 0.305: U$2.3 42.04,28.51 42.02,28.53
RA7  (via drill 0.41, 0.6 pad 1.02)
  Top 0.254: v41.53,20.57 42.02,20.05
  Top 0.305: 13.93,9.92 14.64,9.21 v15.27,9.21 | 42.02,20.05 42.02,17.2 U$2.16 42.04,16.51 41.53,16 41.53,13.87 v41.47,13.81
  Bottom 0.254: 47.85,24.89 44.83,24.89 41.53,21.59 v41.53,20.57
  Bottom 0.305: 52.18,20 48.32,20 47.85,20.48 47.85,24.89 47.85,27.46 47.37,27.94 35.11,27.94 33.21,26.04 24,26.04 23.37,25.4 23.37,21.75 22.57,20.95 19.08,20.95 15.27,17.14 v15.27,9.21
  Bottom 0.406: v41.47,13.82 v41.47,13.81 41.47,7.62 42.73,6.35 JP1.1 | 52.18,20 RFM.4
RB3
  Top 0.279: 32.45,24.77 32.61,24.92 | 32.61,24.92 33.89,26.21 | 31.94,24.77 T3.1 31.78,23.39 R3.1 | 31.94,24.77 32.42,24.77 | 32.42,24.77 32.45,24.77 | 32.45,24.77 32.58,24.77 31.78,23.97 | 32.42,24.77 31.78,24.13 | 32.61,24.92 31.62,24.92 31.62,23.34 31.94,23.34 31.94,24.77
  Top 0.305: U$2.9 34.16,26.48 33.89,26.21
RX  (via drill 0.41)
  Top 0.254: 35.41,27.02 35.46,25.96 35.46,22.91 v35.43,22.61
  Top 0.305: U$2.8 35.43,27.04 35.41,27.02
  Bottom 0.305: v35.43,22.61 35.43,20.19 37.85,17.78 43.56,17.78 44.07,17.27 44.07,15.24 43.56,14.73 40.77,14.73 40.26,14.22 40.26,11.18 38.99,9.91 38.99,6.6 JP1.3
SCK  (via drill 0.41 pad 1.02)
  Top 0.279: 33.86,19.76 31.62,19.76 29.8,19.76 29.45,20.11 25.85,20.11 24.48,18.73 24.48,14.68 23.45,13.65 19.32,13.65 18.13,12.46 18.13,10.48 19.56,9.05 19.56,8.1 19.08,7.62 18.29,7.62 17.97,7.94 16.86,7.94 16.54,7.62 14.64,7.62 13.29,8.97 13.28,8.97 IC2.1
  Top 0.305: v43.78,21.11 47.18,21.11 | v31.62,19.37 31.62,19.61 31.62,19.76 | v31.62,19.37 31.31,19.68 | v31.62,19.37 31.94,19.68 | U$2.10 34.42,19.21 33.86,19.76
  Top 0.406: R11.2 47.18,21.11 R10.1
  Bottom 0.305: v31.62,19.37 31.62,20.59 34.72,23.69 36.29,23.69 37.16,22.76 37.16,20.02 37.69,19.49 42.13,19.49 43.75,21.11 v43.78,21.11
TX  (via drill 0.6)  (1 unrouted)
  Top 0.305: 35.69,17.6 35.69,14.86 34.42,13.59 34.42,12.19 32.64,10.41 v31.12,10.41
  Bottom 0.305: JP1.4 33.83,6.55 33.83,9.96 33.38,10.41 v31.12,10.41
VDD  (via drill 0.6 pad 1.02, 0.7 pad 1.42, 0.9 pad 1.78, 2 pad 3.05)
  Top 0.127: C91.1 C111.1
  Top 0.254: 25.05,13.02 26.14,13.02 G2.+
  Top 0.279: v16.54,25.08 16.46,25 18.45,23.02 25.59,23.02 | 25.59,23.02 26.7,24.13 27.18,24.13 | 25.59,23.02 25.98,23.02 G2.+@1 26.78,23.81 | 26.78,23.81 26.86,23.89 | 27.02,23.65 26.86,23.65 26.86,23.81 | 27.02,23.65 26.7,23.65 | 27.02,23.65 28.29,23.65 28.29,23.81 | 28.29,24.13 27.97,24.13 | 26.78,23.81 26.86,23.81 | 26.86,23.81 26.86,24.13 27.18,24.13 | 26.86,23.81 28.29,23.81 | 28.29,23.81 28.29,24.13 | 26.76,12.45 26.75,12.45 | 25.05,13.02 24.32,13.02 19.56,13.02 18.76,12.22 18.76,10.79 20.19,9.37 20.19,7.78 18.29,5.87 | 17.02,3.97 16.86,3.97 | 17.18,5.24 17.18,3.97 17.02,3.97 | 17.18,5.87 17.18,5.24 | 16.86,3.97 16.86,5.87 | 16.86,5.87 17.02,5.87 | 17.18,5.87 17.02,5.87 | 16.7,3.97 17.02,3.97 | 16.7,3.97 16.86,3.97 | v16.54,4.13 16.7,3.97 | 16.38,3.97 16.22,3.97 16.22,4.92 | 16.38,3.97 v16.54,4.13 | 16.38,3.97 16.7,3.97 | 16.38,3.97 15.91,3.97 15.91,4.76 | v16.7,5.87 16.54,5.87 | v16.7,5.87 16.86,5.87 | v16.7,5.87 16.7,3.97 | 15.91,4.76 15.91,5.56 16.07,5.71 | 17.81,5.87 17.18,5.87 | 17.65,5.71 17.81,5.87 | 17.65,5.71 17.18,5.24 | 18.29,5.87 17.81,5.87 | 15.91,4.76 15.43,5.24 16.07,5.87 | 16.38,5.87 v16.7,5.87 | 16.38,3.97 16.38,5.87 | 16.22,4.92 16.22,5.87 | 16.22,5.87 16.38,5.87 | 16.22,5.87 16.07,5.71 | 16.22,5.87 16.07,5.87 | 16.38,5.87 16.07,5.87 | v16.7,9.53 16.22,9.53 15.59,10.16 14.48,10.16 14.17,10.47 IC2.4 | 7.65,11.19 7.87,10.97 8.68,10.97 IC2.11 | C141.2 6.95,12.22 7.41,12.22 | 7.65,11.19 | v16.7,5.87 18.29,5.87 | 16.07,5.87 v16.7,5.87 | v16.7,5.87 16.54,5.56 16.7,5.24 | 7.65,12.22 7.65,11.19 | 7.65,12.22 | 7.65,12.22 7.41,12.22 | 7.65,12.22 | C91.1 | 7.65,12.22 | 8.29,12.86 7.65,12.22 | 11.46,5.24 11.46,5.87 11.46,6.03 | 11.46,6.03 10.59,6.91 10.58,6.92 IC2.18
  Top 0.279: 8.29,14.61 8.6,14.29 8.6,13.18 | 8.6,13.18 8.29,12.86 | 8.29,14.13 v8.44,14.29 v8.44,13.18 | 8.29,12.86 8.29,13.18 v8.44,13.18 | C41.2 11.46,4.86 11.46,6.03 | 7.97,8.97 7.65,8.65 7.65,6.67 7.65,5.96 C181.2 7.65,5.95 | 7.97,8.97 8.15,8.97 8.68,8.97 IC2.15 | v8.44,13.18 8.6,13.18 | v8.44,3.33 8.29,3.33 8.13,3.33 7.81,3.65 | 7.65,4.79 C151.1 7.81,4.68 | 28.45,24.13 28.29,24.13 | 28.45,24.13 28.45,24.05 28.45,23.73 28.45,23.65 | 27.18,24.13 27.73,24.13 28.45,24.13 | SJ1.2 28.32,24.96 28.29,23.81 | v10.51,14.29 10.43,14.29 10.08,13.94 IC2.9 | 7.41,12.22 7.57,12.22 7.65,12.14 | IC2.14 8.29,9.47 8.28,9.47 8.28,8.97 7.97,8.97 | 26.07,23.02 26.38,23.02 26.86,23.5 27.34,23.97 | 28.61,25.08 28.61,23.5 28.45,23.5 28.45,23.97 28.77,24.29 28.77,25.08 28.29,25.08 28.29,24.61 | 17.02,3.97 17.02,5.87 | 16.54,5.71 17.65,5.71 | 16.07,5.71 16.54,5.71 | 16.54,5.71 v16.54,4.13 | 14.95,5.24 15.27,4.92 | 15.27,4.92 16.22,4.92 | 15.27,4.92 | 16.07,4.13 16.07,3.97 | 16.07,4.13 16.07,5.56 | 15.27,4.92 16.07,4.13 | 16.07,4.13 16.07,4.29 15.59,4.76 | 7.81,3.81
  Top 0.305: 11.46,5.24 14.08,5.24 | 15.99,5.24 16.7,5.24 | C91.1 8.29,14.61 8.29,14.13 8.29,13.18 | 11.46,4.86 11.46,3.81 10.98,3.33 8.13,3.33 | 7.81,3.81 8.29,3.33 | 7.81,3.81 7.81,3.65 | 7.81,4.68 7.81,3.81 | 7.65,4.79 7.65,6.01 7.65,6.03 C181.2 | 28.45,23.73 28.45,23.5 26.86,23.5 | 27.73,24.13 28.21,24.61 | 28.45,24.05 28.45,24.69 28.53,24.77
  Top 0.406: 14.08,5.24 14.95,5.24 15.99,5.24 | 25.78,6.82 C2.P$4 25.83,6.75 v25.91,6.83 | G2.+ 26.76,12.45
  Top 0.61: 26.75,12.45 26.75,9.25 25.78,8.29 25.78,6.82
  Top 0.813: G2.+ 26.76,15.98 v26.7,16.03
  Bottom 0.254: SJ2.2 46.26,2.76 46.27,3.07 IC3.OUT
  Bottom 0.406: v16.7,5.87 v16.7,9.53 | 9.08,14.29 v8.44,14.29 8.44,13.65 | 9.08,14.29 v10.51,14.29 | v8.44,3.33 v8.44,13.18 8.44,13.65 | 8.44,13.65 9.08,14.29 | 27.5,6.83 | 46.26,2.76 IC3.OUT
  Bottom 0.61: 27.5,6.83 27.97,6.35 27.97,3.49 29.24,2.22 45.73,2.22 46.26,2.76 | v25.91,6.83 27.5,6.83 | G2.+@1 26.8,23.75
  Bottom 0.813: v26.7,16.03 26.7,23.74 G2.+@1
(copper drawn outside any net)
  shapes: Top area x2, Top circle x1

### Text on the board
Bottom: www.elektronika.rs.ba | 1 | +
tPlace: RfM PRIJEMNIK | JP za prijemnik | DIFOLT od V4 !!! | GND | 1 | Izlaz sa tr. | GND | + | RB6=T1 | RB7=T2 | MCLR | +Vcc | GND | +Vcc | Gnd | (RB5) | (RB2) | RA1 | RA7 | +V (napajanje) | Tx | Rx | JP za kanal B
tNames: GND | GND | +V
bNames: RfM V4
tDocu: x | x | x | x | x